# EAGLE design led_cube (EAGLE 6.4)
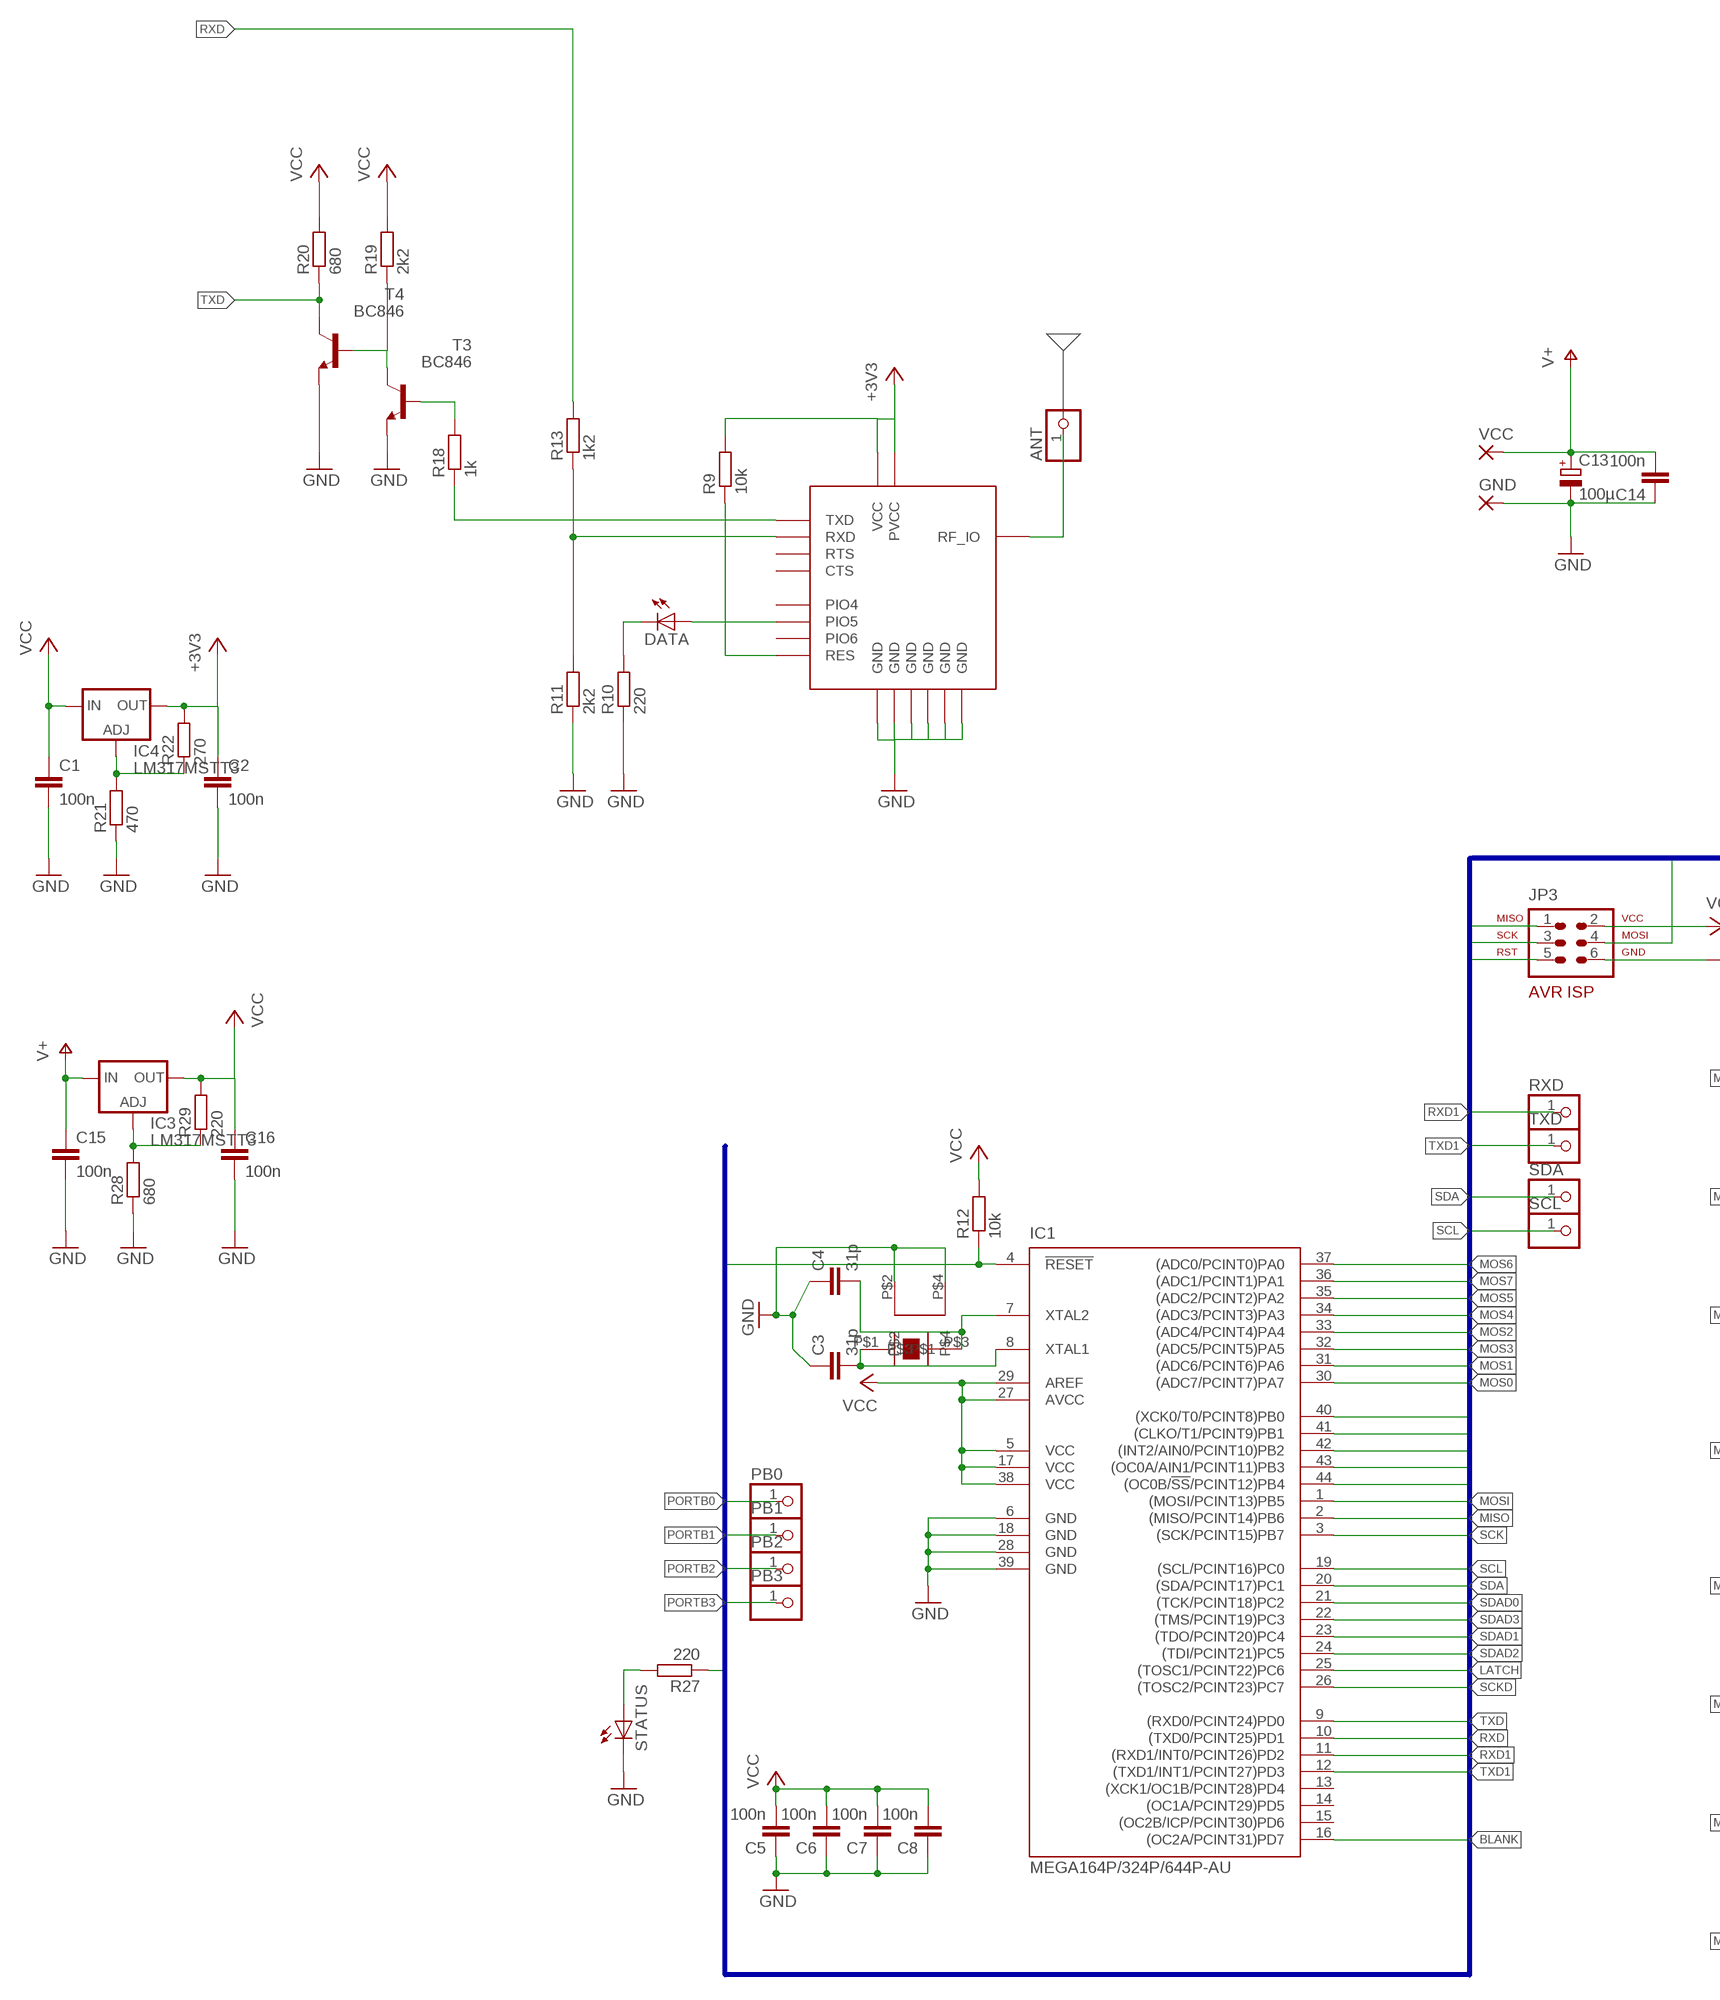
[diagram p0: schematic, sheet 1, part 1 of 2]
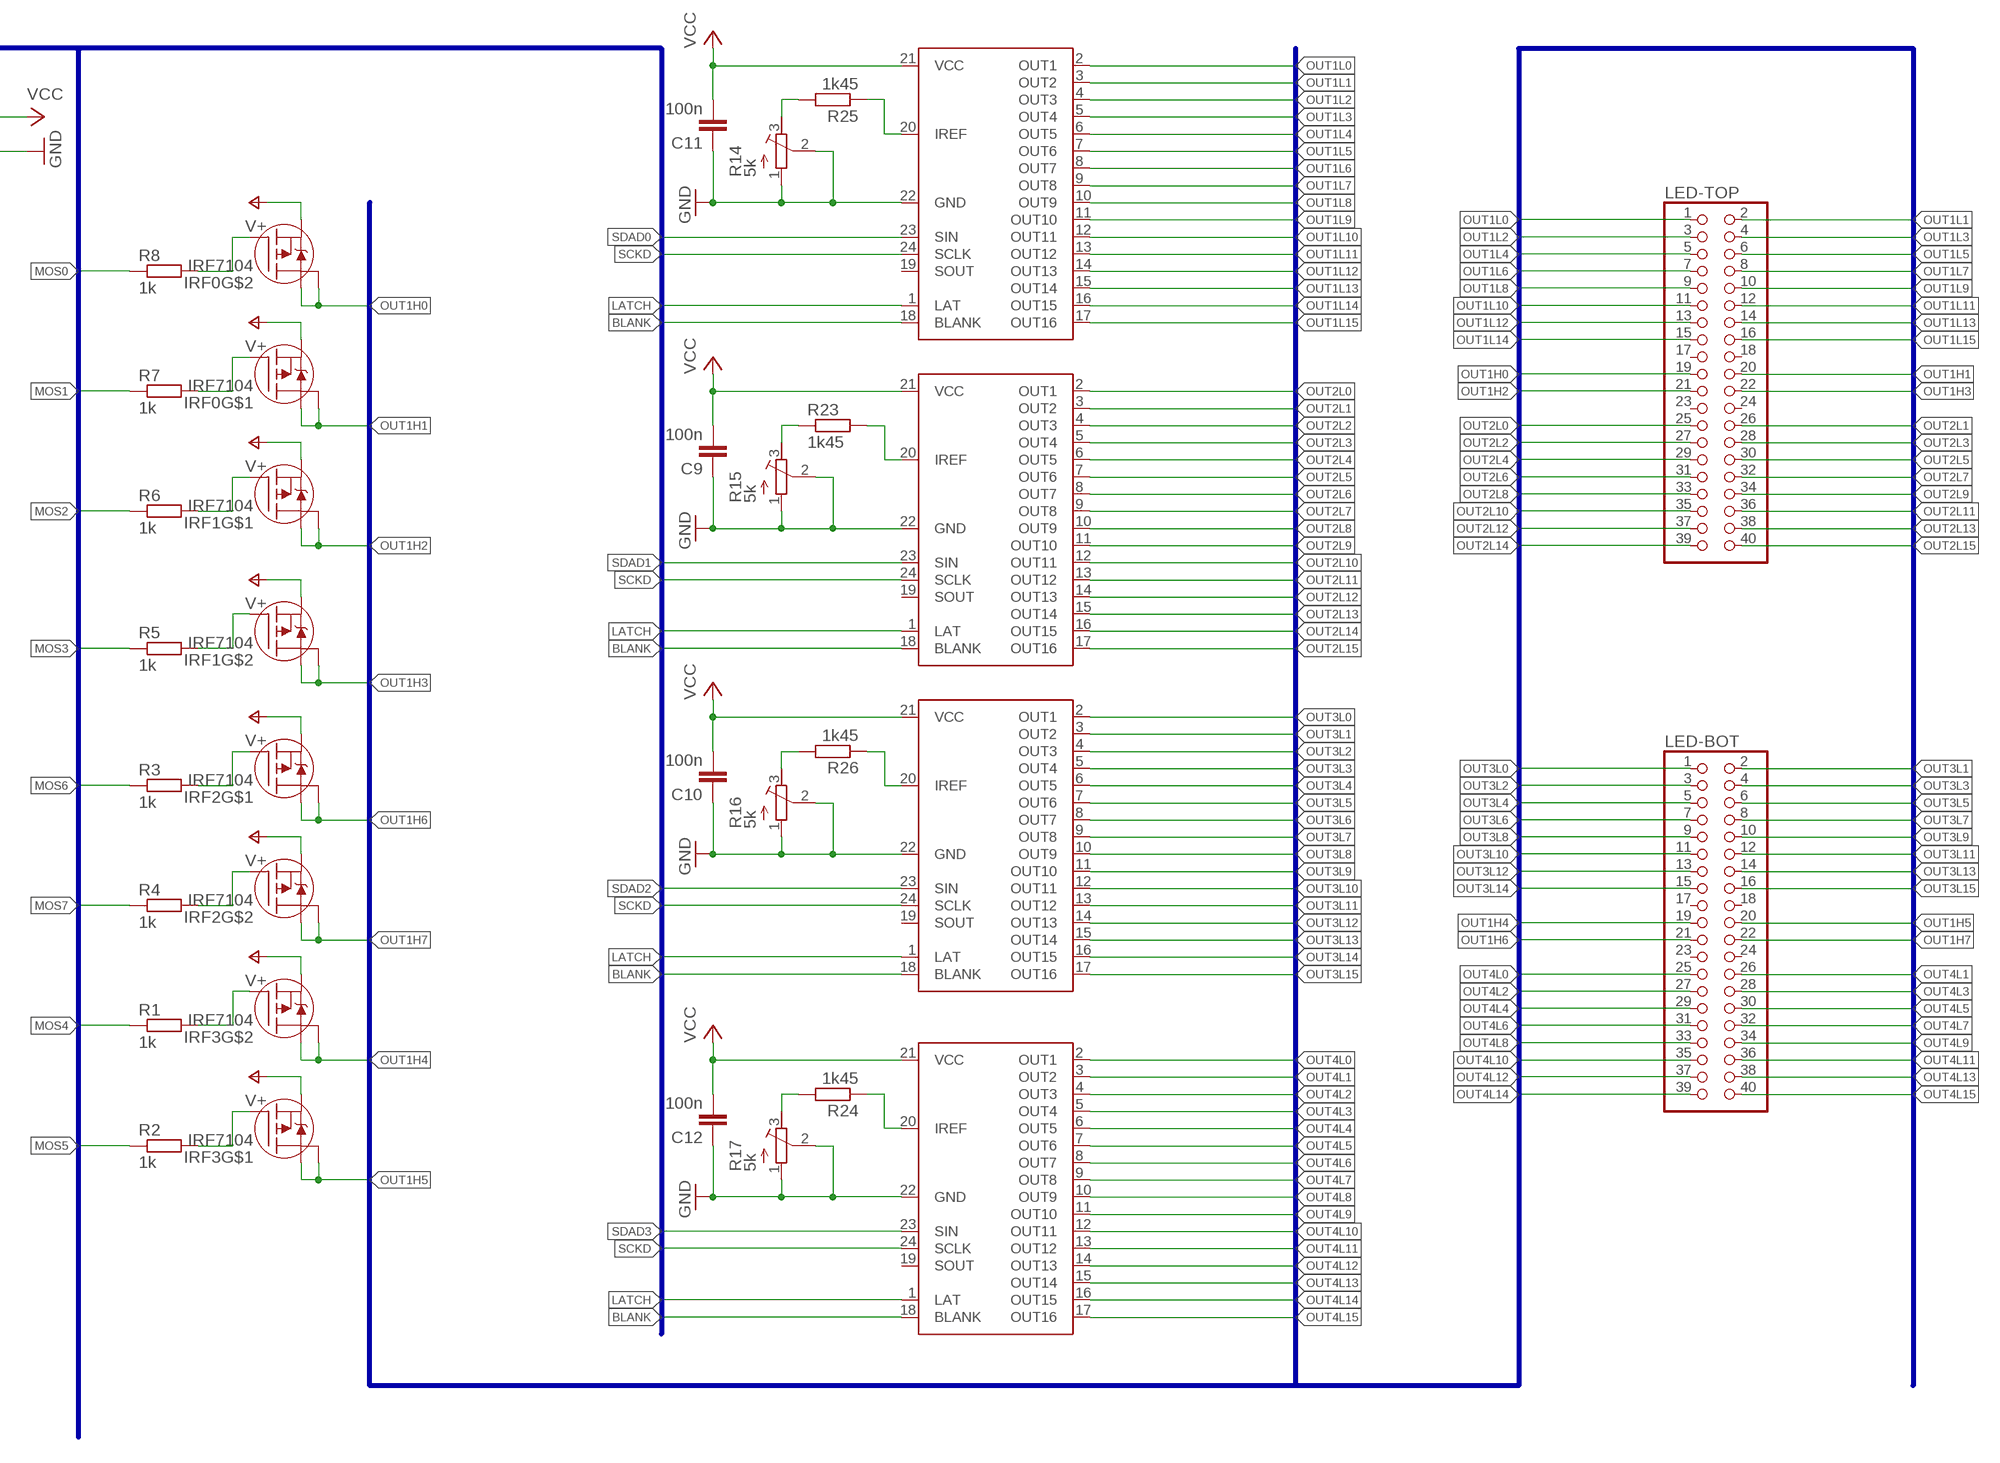
[diagram p1: schematic, sheet 1, part 2 of 2]

## Parts
ANT  PINHD-1X1  [1X01]
C1  100n  C-EUC0805  [C0805]
C2  100n  C-EUC0805  [C0805]
C3  31p  C-EUC0805  [C0805]
C4  31p  C-EUC0805  [C0805]
C5  100n  C-EUC0805  [C0805]
C6  100n  C-EUC0805  [C0805]
C7  100n  C-EUC0805  [C0805]
C8  100n  C-EUC0805  [C0805]
C9  100n  C-EUC0805  [C0805]
C10  100n  C-EUC0805  [C0805]
C11  100n  C-EUC0805  [C0805]
C12  100n  C-EUC0805  [C0805]
C13  100µ  CPOL-EUD  [PANASONIC_D]
C14  100n  C-EUC0805  [C0805]
C15  100n  C-EUC0805  [C0805]
C16  100n  C-EUC0805  [C0805]
DATA  LEDCHIPLED_1206  [CHIPLED_1206]
GND  2,54/1,0  [2,54/1,0]
IC1  MEGA164P/324P/644P-AU  [TQFP44]
IC2  BTM_SER  [BTM_222]
IC3  LM317MSTT3  [SOT223]
IC4  LM317MSTT3  [SOT223]
IRF0  IRF7104  [SO8-2]
IRF1  IRF7104  [SO8-2]
IRF2  IRF7104  [SO8-2]
IRF3  IRF7104  [SO8-2]
JP3  AVR-ISP-6VERT  [AVR-ISP-6]
LED-BOT  PINHD-2X20  [2X20]
LED-TOP  PINHD-2X20  [2X20]
PB0  PINHD-1X1  [1X01]
PB1  PINHD-1X1  [1X01]
PB2  PINHD-1X1  [1X01]
PB3  PINHD-1X1  [1X01]
R1  1k  R-EU_R0805  [R0805]
R2  1k  R-EU_R0805  [R0805]
R3  1k  R-EU_R0805  [R0805]
R4  1k  R-EU_R0805  [R0805]
R5  1k  R-EU_R0805  [R0805]
R6  1k  R-EU_R0805  [R0805]
R7  1k  R-EU_R0805  [R0805]
R8  1k  R-EU_R0805  [R0805]
R9  10k  R-EU_R0805  [R0805]
R10  220  R-EU_R0805  [R0805]
R11  2k2  R-EU_R0805  [R0805]
R12  10k  R-EU_R0805  [R0805]
R13  1k2  R-EU_R0805  [R0805]
R14  5k  R-TRIMM3202  [RTRIM3202]
R15  5k  R-TRIMM3202  [RTRIM3202]
R16  5k  R-TRIMM3202  [RTRIM3202]
R17  5k  R-TRIMM3202  [RTRIM3202]
R18  1k  R-EU_R0805  [R0805]
R19  2k2  R-EU_R0805  [R0805]
R20  680  R-EU_R0805  [R0805]
R21  470  R-EU_R0805  [R0805]
R22  270  R-EU_R0805  [R0805]
R23  1k45  R-EU_R0805  [R0805]
R24  1k45  R-EU_R0805  [R0805]
R25  1k45  R-EU_R0805  [R0805]
R26  1k45  R-EU_R0805  [R0805]
R27  220  R-EU_R0805  [R0805]
R28  680  R-EU_R0805  [R0805]
R29  220  R-EU_R0805  [R0805]
RXD  PINHD-1X1  [1X01]
SCL  PINHD-1X1  [1X01]
SDA  PINHD-1X1  [1X01]
STATUS  LEDCHIPLED_1206  [CHIPLED_1206]
T3  BC846  [SOT23]
T4  BC846  [SOT23]
TLC0  TLC5929RGE  [HVQFN24]
TLC1  TLC5929RGE  [HVQFN24]
TLC2  TLC5929RGE  [HVQFN24]
TLC3  TLC5929RGE  [HVQFN24]
TXD  PINHD-1X1  [1X01]
U$9  ABMM2  [ABMM2]
VCC  2,54/1,0  [2,54/1,0]

## Nets
+3V3: C2.1 IC2.P$2(PVCC) IC2.P$17(VCC) IC4.4(OUT) R9.2 R22.2
BLANK: IC1.16((OC2A/PCINT31)PD7) TLC0.18(BLANK) TLC1.18(BLANK) TLC2.18(BLANK) TLC3.18(BLANK)
GND: C1.2 C2.2 C3.1 C4.1 C5.1 C6.1 C7.1 C8.1 C9.1 C10.1 C11.1 C12.1 C13.- C14.1 C15.2 C16.2 GND.1(P) IC1.6(GND) IC1.18(GND) IC1.28(GND) IC1.39(GND) IC2.P$1(GND) IC2.P$10(GND) IC2.P$18(GND) IC2.P$19(GND) IC2.P$29(GND) IC2.P$38(GND) JP3.6 R10.1 R11.1 R14.1(A) R14.2(S) R15.1(A) R15.2(S) R16.1(A) R16.2(S) R17.1(A) R17.2(S) R21.1 R28.1 STATUS.C T3.2(E) T4.2(E) TLC0.22(GND) TLC1.22(GND) TLC2.22(GND) TLC3.22(GND) U$9.P$2 U$9.P$4
LATCH: IC1.25((TOSC1/PCINT22)PC6) TLC0.1(LAT) TLC1.1(LAT) TLC2.1(LAT) TLC3.1(LAT)
MISO: IC1.2((MISO/PCINT14)PB6) JP3.1
MOS0: IC1.30((ADC7/PCINT7)PA7) R8.1
MOS1: IC1.31((ADC6/PCINT6)PA6) R7.1
MOS2: IC1.33((ADC4/PCINT4)PA4) R6.1
MOS3: IC1.32((ADC5/PCINT5)PA5) R5.1
MOS4: IC1.34((ADC3/PCINT3)PA3) R1.1
MOS5: IC1.35((ADC2/PCINT2)PA2) R2.1
MOS6: IC1.37((ADC0/PCINT0)PA0) R3.1
MOS7: IC1.36((ADC1/PCINT1)PA1) R4.1
MOSI: IC1.1((MOSI/PCINT13)PB5) JP3.4
N$1: C3.2 IC1.8(XTAL1) U$9.P$1
N$2: IC2.P$26(RXD) R11.2 R13.1
N$3: C4.2 IC1.7(XTAL2) U$9.P$3
N$4: IRF3.2(G) R2.2
N$5: IC2.P$16(RES) R9.1
N$6: DATA.A IC2.P$11(PIO5)
N$7: DATA.C R10.2
N$8: IRF3.4(G) R1.2
N$9: IRF2.4(G) R4.2
N$10: IC2.P$27(TXD) R18.1
N$11: R18.2 T3.1(B)
N$12: R19.1 T3.3(C) T4.1(B)
N$13: IRF2.2(G) R3.2
N$14: IC4.1(ADJ) R21.2 R22.1
N$15: IRF1.4(G) R5.2
N$16: IRF1.2(G) R6.2
N$17: IRF0.2(G) R7.2
N$18: IRF0.4(G) R8.2
N$19: R24.1 TLC3.20(IREF)
N$20: R17.3(E) R24.2
N$21: R16.3(E) R26.2
N$22: R26.1 TLC2.20(IREF)
N$23: R23.2 TLC1.20(IREF)
N$24: R15.3(E) R23.1
N$25: R14.3(E) R25.2
N$26: R25.1 TLC0.20(IREF)
N$27: ANT.1 IC2.P$37(RF_IO)
N$28: R27.2 STATUS.A
N$29: IC3.1(ADJ) R28.2 R29.1
OUT1H0: IRF0.5(D) IRF0.6(D) LED-TOP.19
OUT1H1: IRF0.7(D) IRF0.8(D) LED-TOP.20
OUT1H2: IRF1.7(D) IRF1.8(D) LED-TOP.21
OUT1H3: IRF1.5(D) IRF1.6(D) LED-TOP.22
OUT1H4: IRF3.5(D) IRF3.6(D) LED-BOT.19
OUT1H5: IRF3.7(D) IRF3.8(D) LED-BOT.20
OUT1H6: IRF2.7(D) IRF2.8(D) LED-BOT.21
OUT1H7: IRF2.5(D) IRF2.6(D) LED-BOT.22
OUT1L0: LED-TOP.1 TLC0.2(OUT1)
OUT1L1: LED-TOP.2 TLC0.3(OUT2)
OUT1L2: LED-TOP.3 TLC0.4(OUT3)
OUT1L3: LED-TOP.4 TLC0.5(OUT4)
OUT1L4: LED-TOP.5 TLC0.6(OUT5)
OUT1L5: LED-TOP.6 TLC0.7(OUT6)
OUT1L6: LED-TOP.7 TLC0.8(OUT7)
OUT1L7: LED-TOP.8 TLC0.9(OUT8)
OUT1L8: LED-TOP.9 TLC0.10(OUT9)
OUT1L9: LED-TOP.10 TLC0.11(OUT10)
OUT1L10: LED-TOP.11 TLC0.12(OUT11)
OUT1L11: LED-TOP.12 TLC0.13(OUT12)
OUT1L12: LED-TOP.13 TLC0.14(OUT13)
OUT1L13: LED-TOP.14 TLC0.15(OUT14)
OUT1L14: LED-TOP.15 TLC0.16(OUT15)
OUT1L15: LED-TOP.16 TLC0.17(OUT16)
OUT2L0: LED-TOP.25 TLC1.2(OUT1)
OUT2L1: LED-TOP.26 TLC1.3(OUT2)
OUT2L2: LED-TOP.27 TLC1.4(OUT3)
OUT2L3: LED-TOP.28 TLC1.5(OUT4)
OUT2L4: LED-TOP.29 TLC1.6(OUT5)
OUT2L5: LED-TOP.30 TLC1.7(OUT6)
OUT2L6: LED-TOP.31 TLC1.8(OUT7)
OUT2L7: LED-TOP.32 TLC1.9(OUT8)
OUT2L8: LED-TOP.33 TLC1.10(OUT9)
OUT2L9: LED-TOP.34 TLC1.11(OUT10)
OUT2L10: LED-TOP.35 TLC1.12(OUT11)
OUT2L11: LED-TOP.36 TLC1.13(OUT12)
OUT2L12: LED-TOP.37 TLC1.14(OUT13)
OUT2L13: LED-TOP.38 TLC1.15(OUT14)
OUT2L14: LED-TOP.39 TLC1.16(OUT15)
OUT2L15: LED-TOP.40 TLC1.17(OUT16)
OUT3L0: LED-BOT.1 TLC2.2(OUT1)
OUT3L1: LED-BOT.2 TLC2.3(OUT2)
OUT3L2: LED-BOT.3 TLC2.4(OUT3)
OUT3L3: LED-BOT.4 TLC2.5(OUT4)
OUT3L4: LED-BOT.5 TLC2.6(OUT5)
OUT3L5: LED-BOT.6 TLC2.7(OUT6)
OUT3L6: LED-BOT.7 TLC2.8(OUT7)
OUT3L7: LED-BOT.8 TLC2.9(OUT8)
OUT3L8: LED-BOT.9 TLC2.10(OUT9)
OUT3L9: LED-BOT.10 TLC2.11(OUT10)
OUT3L10: LED-BOT.11 TLC2.12(OUT11)
OUT3L11: LED-BOT.12 TLC2.13(OUT12)
OUT3L12: LED-BOT.13 TLC2.14(OUT13)
OUT3L13: LED-BOT.14 TLC2.15(OUT14)
OUT3L14: LED-BOT.15 TLC2.16(OUT15)
OUT3L15: LED-BOT.16 TLC2.17(OUT16)
OUT4L0: LED-BOT.25 TLC3.2(OUT1)
OUT4L1: LED-BOT.26 TLC3.3(OUT2)
OUT4L2: LED-BOT.27 TLC3.4(OUT3)
OUT4L3: LED-BOT.28 TLC3.5(OUT4)
OUT4L4: LED-BOT.29 TLC3.6(OUT5)
OUT4L5: LED-BOT.30 TLC3.7(OUT6)
OUT4L6: LED-BOT.31 TLC3.8(OUT7)
OUT4L7: LED-BOT.32 TLC3.9(OUT8)
OUT4L8: LED-BOT.33 TLC3.10(OUT9)
OUT4L9: LED-BOT.34 TLC3.11(OUT10)
OUT4L10: LED-BOT.35 TLC3.12(OUT11)
OUT4L11: LED-BOT.36 TLC3.13(OUT12)
OUT4L12: LED-BOT.37 TLC3.14(OUT13)
OUT4L13: LED-BOT.38 TLC3.15(OUT14)
OUT4L14: LED-BOT.39 TLC3.16(OUT15)
OUT4L15: LED-BOT.40 TLC3.17(OUT16)
PORTB0: IC1.40((XCK0/T0/PCINT8)PB0) PB0.1
PORTB1: IC1.41((CLKO/T1/PCINT9)PB1) PB1.1
PORTB2: IC1.42((INT2/AIN0/PCINT10)PB2) PB2.1
PORTB3: IC1.43((OC0A/AIN1/PCINT11)PB3) PB3.1
PORTB4: IC1.44((OC0B/!SS!/PCINT12)PB4) R27.1
RST: IC1.4(!RESET) JP3.5 R12.1
RXD: IC1.10((TXD0/PCINT25)PD1) R13.2
RXD1: IC1.11((RXD1/INT0/PCINT26)PD2) RXD.1
SCK: IC1.3((SCK/PCINT15)PB7) JP3.3
SCKD: IC1.26((TOSC2/PCINT23)PC7) TLC0.24(SCLK) TLC1.24(SCLK) TLC2.24(SCLK) TLC3.24(SCLK)
SCL: IC1.19((SCL/PCINT16)PC0) SCL.1
SDA: IC1.20((SDA/PCINT17)PC1) SDA.1
SDAD0: IC1.21((TCK/PCINT18)PC2) TLC0.23(SIN)
SDAD1: IC1.23((TDO/PCINT20)PC4) TLC1.23(SIN)
SDAD2: IC1.24((TDI/PCINT21)PC5) TLC2.23(SIN)
SDAD3: IC1.22((TMS/PCINT19)PC3) TLC3.23(SIN)
TXD: IC1.9((RXD0/PCINT24)PD0) R20.1 T4.3(C)
TXD1: IC1.12((TXD1/INT1/PCINT27)PD3) TXD.1
V+: C13.+ C14.2 C15.1 IC3.3(IN) IRF0.1(S) IRF0.3(S) IRF1.1(S) IRF1.3(S) IRF2.1(S) IRF2.3(S) IRF3.1(S) IRF3.3(S) VCC.1(P)
VCC: C1.1 C5.2 C6.2 C7.2 C8.2 C9.2 C10.2 C11.2 C12.2 C16.1 IC1.5(VCC) IC1.17(VCC) IC1.27(AVCC) IC1.29(AREF) IC1.38(VCC) IC3.4(OUT) IC4.3(IN) JP3.2 R12.2 R19.2 R20.2 R29.2 TLC0.21(VCC) TLC1.21(VCC) TLC2.21(VCC) TLC3.21(VCC)
Unconnected: IC1.13((XCK1/OC1B/PCINT28)PD4) IC1.14((OC1A/PCINT29)PD5) IC1.15((OC2B/ICP/PCINT30)PD6) IC2.P$9(PIO4) IC2.P$12(PIO6) IC2.P$28(RTS) IC2.P$30(CTS) LED-BOT.17 LED-BOT.18 LED-BOT.23 LED-BOT.24 LED-TOP.17 LED-TOP.18 LED-TOP.23 LED-TOP.24 TLC0.19(SOUT) TLC1.19(SOUT) TLC2.19(SOUT) TLC3.19(SOUT)

## Buses
MISO,MOSI,SCK,RST,SCKD,SDAD[0..3],MOS[0..7],BLANK,LATCH,RXD,TXD,RXD1,TXD1,SDA,SCL,PORTB[0..4]
OUT1L[0..15],OUT2L[0..15],OUT3L[0..15],OUT4L[0..15],OUT1H[0..7]

## Library data of the parts
ANT PB0 PB1-PB3 RXD SCL SDA TXD = pinhead:PINHD-1X1: PIN HEADER
C1-C12 C14-C16 = resistor:C-EU: CAPACITOR, European symbol
C13 = rcl:CPOL-EU: POLARIZED CAPACITOR, European symbol
DATA STATUS = led:LED: LED OSRAM: - CHIPLED LG R971, LG N971, LY N971, LG Q971, LY Q971, LO R971, LY R971 LH N974, LH R974 LS Q976, LO Q976, LY Q976 LO Q996 - Hyper CHIPLED LW Q18S LB Q993, LB Q99A, LB R99A - SideLED LS A670, LO A670, LY A670, LG A670, LP A670 LB A673, LV A673, LT A673, LW A673 LH A674 LY A675 LS A676, LA A676, LO A676, LY A676, LW A676 LS A679, LY A679, LG A679 - Hyper Micro SIDELED® LS Y876, LA Y876, LO Y876, LY Y876 LT Y87S - SmartLED LW L88C, LW L88S LB L89C, LB L89S, LG L890 LS L89K, LO L89K, LY L89K LS L896, LA L896, LO L896, LY L896 - TOPLED LS T670, LO T670, LY T670, LG T670, LP T670 LSG T670, LSP T670, LSY T670, LOP T670, LYG T670 LG T671, LOG T671, LSG T671 LB T673, LV T673, LT T673, LW T673 LH T674 LS T676, LA T676, LO T676, LY T676, LB T676, LH T676, LSB T676, LW T676 LB T67C, LV T67C, LT T67C, LS T67K, LO T67K, LY T67K, LW E67C LS E67B, LA E67B, LO E67B, LY E67B, LB E67C, LV E67C, LT E67C LW T67C LS T679, LY T679, LG T679 LS T770, LO T770, LY T770, LG T770, LP T770 LB T773, LV T773, LT T773, LW T773 LH T774 LS E675, LA E675, LY E675, LS T675 LS T776, LA T776, LO T776, LY T776, LB T776 LHGB T686 LT T68C, LB T68C - Hyper Mini TOPLED® LB M676 - Mini TOPLED Santana® LG M470 LS M47K, LO M47K, LY M47K Source: http://www.osram.convergy.de LUXEON: - LUMILED® LXK2-PW12-R00, LXK2-PW12-S00, LXK2-PW14-U00, LXK2-PW14-V00 LXK2-PM12-R00, LXK2-PM12-S00, LXK2-PM14-U00 LXK2-PE12-Q00, LXK2-PE12-R00, LXK2-PE12-S00, LXK2-PE14-T00, LXK2-PE14-U00 LXK2-PB12-K00, LXK2-PB12-L00, LXK2-PB12-M00, LXK2-PB14-N00, LXK2-PB14-P00, LXK2-PB14-Q00 LXK2-PR12-L00, LXK2-PR12-M00, LXK2-PR14-Q00, LXK2-PR14-R00 LXK2-PD12-Q00, LXK2-PD12-R00, LXK2-PD12-S00 LXK2-PH12-R00, LXK2-PH12-S00 LXK2-PL12-P00, LXK2-PL12-Q00, LXK2-PL12-R00 Source: www.luxeon.com KINGBRIGHT: KA-3528ASYC Source: www.kingbright.com
GND VCC = wirepad:2,54/1,0: THROUGH-HOLE PAD
IC1 = avr-7:MEGA164P/324P/644P-AU
IC2 = BTM222:BTM_SER
IC3 IC4 = v-reg:LM317?*: 500 mA Adjustable Output Positive Voltage Regulator Source: http://www.onsemi.co.jp .. LM317M-D.PDF
IRF0 IRF1-IRF3 = irf-2:IRF7104: HEXFET® Power MOSFET Adavanced Process Technology Ultra Low On-Resistance Dual P-Channel MOSFET Surface Mount Available in Tape & Reel Dynamic dv/dt Rating Fast Switching Please connect both Drain-Pins of each FET for thermal Reasons! (Pin 5 with Pin 6, 7 with 8)
JP3 = avr-7:AVR-ISP-6: AVR ISP-6 Serial Programming Header
LED-BOT LED-TOP = pinhead:PINHD-2X20: PIN HEADER
R1-R13 R18-R29 = resistor:R-EU_: RESISTOR, European symbol
R14-R17 = rcl:R-TRIMM: Trimm resistor
T3 T4 = transistor:BC846: NPN TRANSISTOR
TLC0 TLC1-TLC3 = texas:TLC5929
U$9 = crystal:ABMM2

## Board
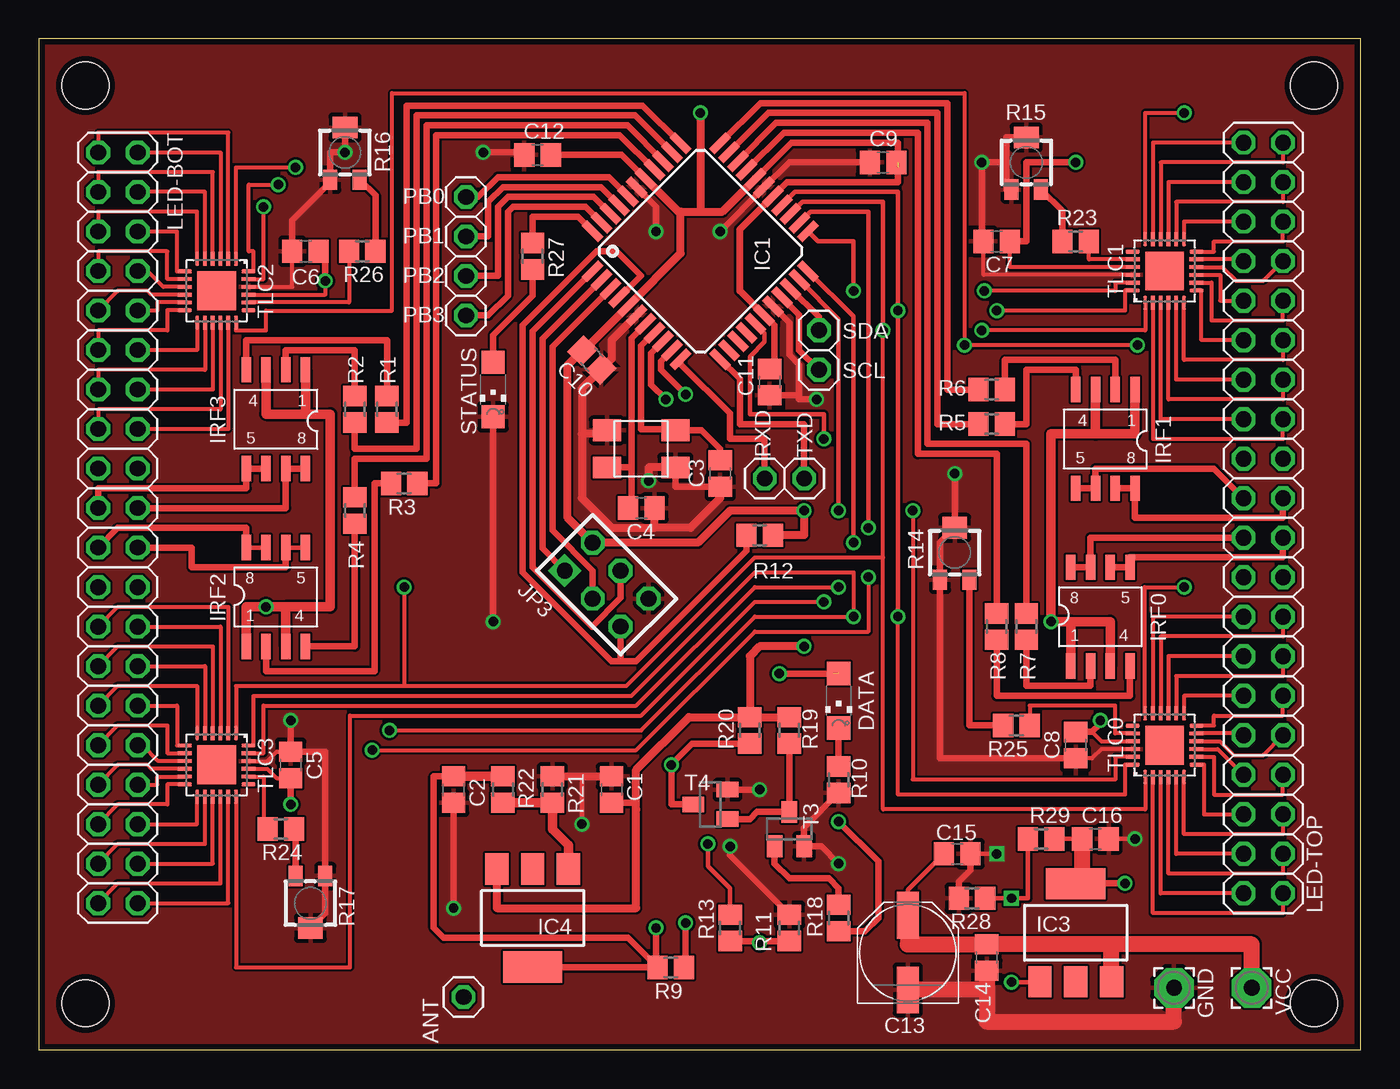
[diagram p2: board, top side]
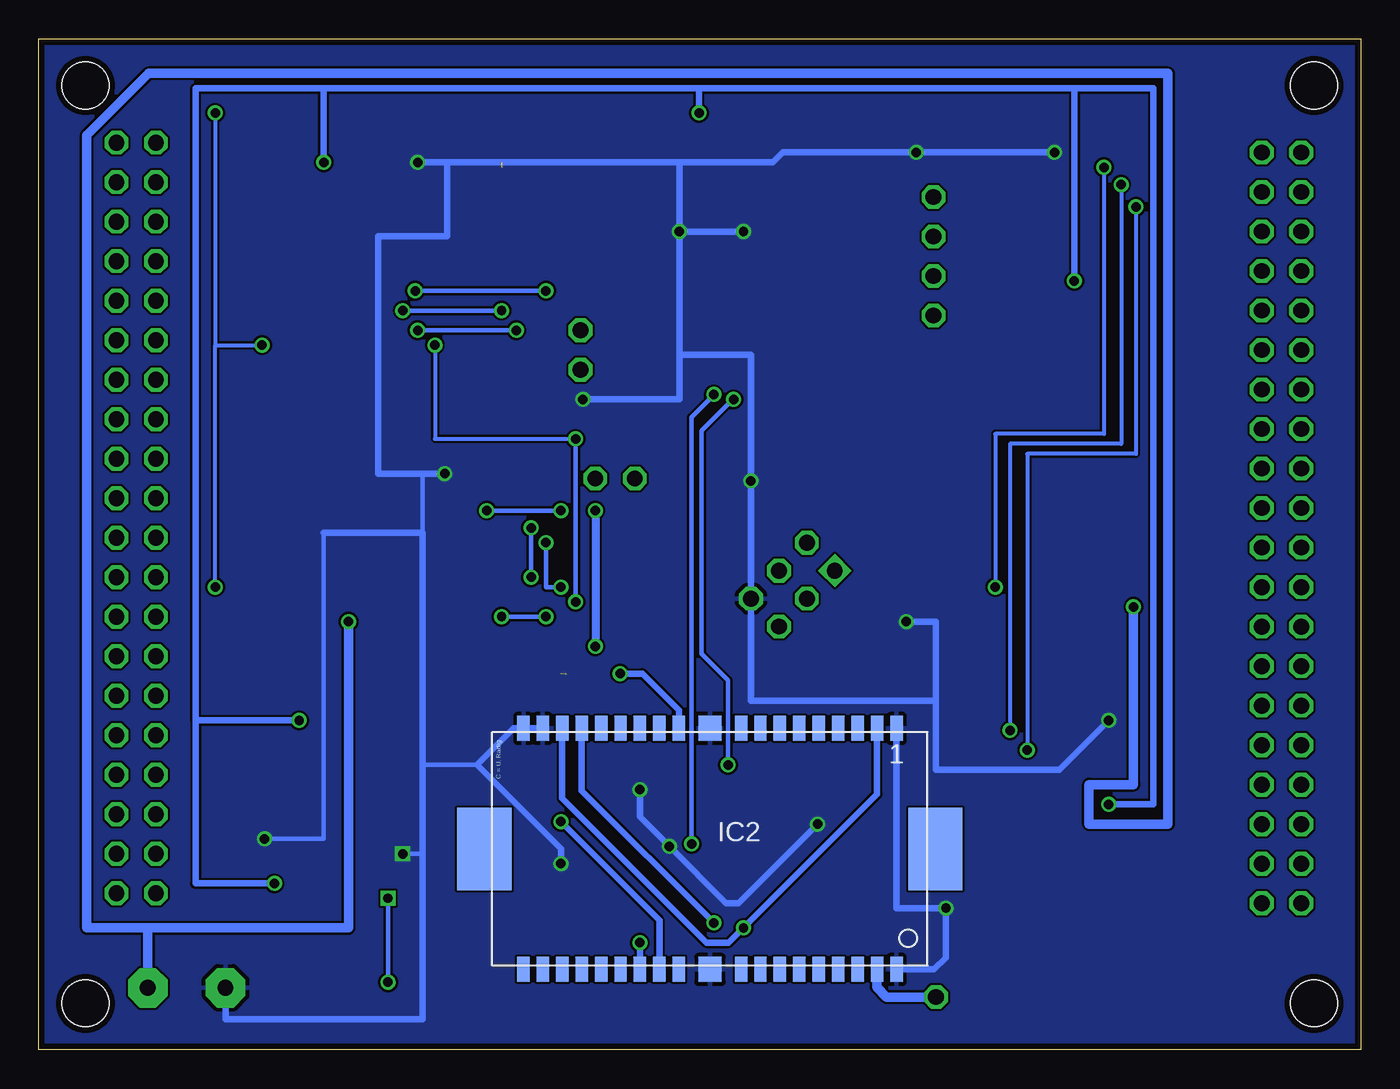
[diagram p3: board, bottom side, seen from below]

Size 85 x 65 mm. Coordinates in mm from the lower left corner, seen from the top.
Outline: 0,65 0,0 85,0 85,65 0,65
Copper layers (1*16): Top 0.0356mm / dielectric 1.5011mm / Bottom 0.0356mm
Design rules "LaenPCBOrder *": minimum track width 6mil, minimum drill 13mil, track to track 6mil, track to pad 6mil, pad to pad 6mil, via to via 6mil, smd to smd 6mil, copper to edge 15mil, drill to drill 6mil, minimum pad ring 7mil, minimum via ring 7mil, stop-mask expansion 3mil, vias tented up to drill 0mil, thermal gap 10mil
Holes 3 mm at 3,62 3,3 82,62 82,3

### Footprints (pad centres in the part's own frame; a part is rotated, then mirrored left to right if it is on the bottom)
1X01 = drill 1.016 octagon: 1 0,0
C0805 = smd 1.3 x 1.5: 1 -0.85,0; 2 0.85,0
PANASONIC_D = smd 3 x 1.4: + 2.4,0; - -2.4,0
CHIPLED_1206 = smd 1.5 x 1.5: A 0,-1.75; C 0,1.75
2,54/1,0 = drill 1.016 pad 2.54 octagon: 1 0,0
TQFP44 = smd 1.5 x 0.5: 1 -5.8,4; 2 -5.8,3.2; 3 -5.8,2.4; 4 -5.8,1.6; 5 -5.8,0.8; 6 -5.8,0; 7 -5.8,-0.8; 8 -5.8,-1.6; 9 -5.8,-2.4; 10 -5.8,-3.2; 11 -5.8,-4; 23 5.8,-4; 24 5.8,-3.2; 25 5.8,-2.4; 26 5.8,-1.6; 27 5.8,-0.8; 28 5.8,0; 29 5.8,0.8; 30 5.8,1.6; 31 5.8,2.4; 32 5.8,3.2; 33 5.8,4 | smd 0.5 x 1.5: 12 -4,-5.8; 13 -3.2,-5.8; 14 -2.4,-5.8; 15 -1.6,-5.8; 16 -0.8,-5.8; 17 0,-5.8; 18 0.8,-5.8; 19 1.6,-5.8; 20 2.4,-5.8; 21 3.2,-5.8; 22 4,-5.8; 34 4,5.8; 35 3.2,5.8; 36 2.4,5.8; 37 1.6,5.8; 38 0.8,5.8; 39 0,5.8; 40 -0.8,5.8; 41 -1.6,5.8; 42 -2.4,5.8; 43 -3.2,5.8; 44 -4,5.8
BTM_222 = smd 0.8 x 1.6: P$1 -11.43,-7.75; P$2 -10.18,-7.75; P$3 -8.93,-7.75; P$4 -7.68,-7.75; P$5 -6.43,-7.75; P$6 -5.18,-7.75; P$7 -3.93,-7.75; P$8 -2.68,-7.75; P$9 -1.43,-7.75; P$11 2.57,-7.75; P$12 3.82,-7.75; P$13 5.07,-7.75; P$14 6.32,-7.75; P$15 7.57,-7.75; P$16 8.82,-7.75; P$17 10.07,-7.75; P$18 11.32,-7.75; P$19 12.57,-7.75; P$20 12.57,7.75; P$21 11.32,7.75; P$22 10.07,7.75; P$23 8.82,7.75; P$24 7.57,7.75; P$25 6.32,7.75; P$26 5.07,7.75; P$27 3.82,7.75; P$28 2.57,7.75; P$30 -1.43,7.75; P$31 -2.68,7.75; P$32 -3.93,7.75; P$33 -5.18,7.75; P$34 -6.43,7.75; P$35 -7.68,7.75; P$36 -8.93,7.75; P$37 -10.18,7.75; P$38 -11.43,7.75 | smd 1.5 x 1.6: P$10 0.57,-7.75; P$29 0.57,7.75 | smd 3.5 x 5.3: P$39 -13.93,0; P$40 15.07,0
SOT223 = smd 1.5 x 2: 1 -2.3,-3.15; 2 0,-3.15; 3 2.3,-3.15 | smd 3.8 x 2: 4 0,3.15
SO8-2 = smd 0.61 x 1.626: 1 -2.54,-2.54; 2 -1.27,-2.54; 3 0,-2.54; 4 1.27,-2.54; 5 1.27,3.81; 6 0,3.81; 7 -1.27,3.81; 8 -2.54,3.81
AVR-ISP-6 = drill 1.016 square: 1 -2.54,-1.27 | drill 1.016 octagon: 2 -2.54,1.27; 3 0,-1.27; 4 0,1.27; 5 2.54,-1.27; 6 2.54,1.27
2X20 = drill 1.016 octagon: 1 -24.13,-1.27; 2 -24.13,1.27; 3 -21.59,-1.27; 4 -21.59,1.27; 5 -19.05,-1.27; 6 -19.05,1.27; 7 -16.51,-1.27; 8 -16.51,1.27; 9 -13.97,-1.27; 10 -13.97,1.27; 11 -11.43,-1.27; 12 -11.43,1.27; 13 -8.89,-1.27; 14 -8.89,1.27; 15 -6.35,-1.27; 16 -6.35,1.27; 17 -3.81,-1.27; 18 -3.81,1.27; 19 -1.27,-1.27; 20 -1.27,1.27; 21 1.27,-1.27; 22 1.27,1.27; 23 3.81,-1.27; 24 3.81,1.27; 25 6.35,-1.27; 26 6.35,1.27; 27 8.89,-1.27; 28 8.89,1.27; 29 11.43,-1.27; 30 11.43,1.27; 31 13.97,-1.27; 32 13.97,1.27; 33 16.51,-1.27; 34 16.51,1.27; 35 19.05,-1.27; 36 19.05,1.27; 37 21.59,-1.27; 38 21.59,1.27; 39 24.13,-1.27; 40 24.13,1.27
R0805 = smd 1.3 x 1.5: 1 -0.85,0; 2 0.85,0
RTRIM3202 = smd 0.9 x 1.3: 1 -0.95,-1.75; 3 0.95,-1.75 | smd 1.6 x 1.4: 2 0,1.6
SOT23 = smd 1 x 1.4: 1 -0.95,-1.1; 2 0.95,-1.1; 3 0,1.1
HVQFN24 = smd 0.9 x 0.24: 1 -2.05,1.25; 2 -2.05,0.75; 3 -2.05,0.25; 4 -2.05,-0.25; 5 -2.05,-0.75; 6 -2.05,-1.25; 13 2.05,-1.25; 14 2.05,-0.75; 15 2.05,-0.25; 16 2.05,0.25; 17 2.05,0.75; 18 2.05,1.25 | smd 0.24 x 0.9: 7 -1.25,-2.05; 8 -0.75,-2.05; 9 -0.25,-2.05; 10 0.25,-2.05; 11 0.75,-2.05; 12 1.25,-2.05; 19 1.25,2.05; 20 0.75,2.05; 21 0.25,2.05; 22 -0.25,2.05; 23 -0.75,2.05; 24 -1.25,2.05 | smd 2.5 x 2.5: 25 0,0 | smd 0.25 x 0.25: M1 -1.87,1.87
ABMM2 = smd 1.8 x 1.4: P$1 -2.2,-1.2; P$2 2.2,-1.2; P$3 2.2,1.2; P$4 -2.2,1.2

### Placement (x,y rotation side)
ANT  27.3,3.41 270 top
C1  36.83,16.74 90 top
C2  26.67,16.74 270 top
C3  43.82,37.06 90 top
C4  38.73,34.84 180 top
C5  16.19,18.33 270 top
C6  17.14,51.35 0 top
C7  61.6,51.98 0 top
C8  66.67,19.6 90 top
C9  54.29,57.06 0 top
C10  35.56,44.36 135 top
C11  46.99,42.93 90 top
C12  32.07,57.54 0 top
C13  55.88,6.26 90 top
C14  60.96,5.95 90 top
C15  59.05,12.61 0 top
C16  67.95,13.56 0 top
DATA  51.44,22.45 180 top
GND  73,4 270 top
IC1  42.55,51.35 45 top
IC2  41.27,12.93 180 bottom
IC3  66.67,7.53 0 top
IC4  31.75,8.48 180 top
IRF0  68.9,27.22 0 top
IRF1  67.95,39.92 180 top
IRF2  15.88,28.49 0 top
IRF3  14.61,41.19 180 top
JP3  36.51,29.92 315 top
LED-BOT  5.08,33.57 270 top
LED-TOP  78.74,34.2 90 top
PB0  27.46,54.84 270 top
PB1  27.46,52.3 270 top
PB2  27.46,49.76 270 top
PB3  27.46,47.22 270 top
R1  22.38,41.19 90 top
R2  20.32,41.19 90 top
R3  23.5,36.43 180 top
R4  20.32,34.68 270 top
R5  61.28,40.23 0 top
R6  61.28,42.46 0 top
R7  63.5,27.22 270 top
R8  61.6,27.22 270 top
R9  40.64,5.31 180 top
R10  51.44,17.38 90 top
R11  48.26,7.85 270 top
R12  46.36,33.09 0 top
R13  44.45,7.85 90 top
R14  58.9,31.98 0 top
R15  63.5,57.06 0 top
R16  19.69,57.7 0 top
R17  17.46,9.44 180 top
R18  51.44,8.48 90 top
R19  48.26,20.55 90 top
R20  45.72,20.55 90 top
R21  33.02,16.74 270 top
R22  29.85,16.74 90 top
R23  66.67,51.98 0 top
R24  15.56,14.2 0 top
R25  62.86,20.87 180 top
R26  20.8,51.35 0 top
R27  31.75,51.03 270 top
R28  60.01,9.75 0 top
R29  64.45,13.56 0 top
RXD  46.67,36.74 270 top
SCL  50.17,43.73 270 top
SDA  50.17,46.27 270 top
STATUS  29.21,42.46 180 top
T3  48.26,14.2 0 top
T4  43.18,15.79 90 top
TLC0  72.39,19.6 90 top
TLC1  72.39,50.08 90 top
TLC2  11.43,48.81 270 top
TLC3  11.43,18.33 270 top
TXD  49.21,36.74 270 top
U$9  38.73,38.65 180 top
VCC  78,4 270 top

### Tracks (layer width: path | path; a pad name or v marks a point on that pad's centre or on a via)
+3V3  (via drill 0.61)
  Top 0.406: IC4.4 31.77,5.31 R9.2 | R9.2 37.88,7.22 26.04,7.22 25.4,7.85 25.4,17.59 C2.1 | R9.2 39.69,5.41 v39.69,7.85
  Top 0.61: C2.1 R22.2
  Bottom 0.406: IC2.P$2 31.1,16.44 v39.69,7.85 40.64,6.9 42.07,6.9 51.35,16.17 IC2.P$17
BLANK  (via drill 0.61)
  Top 0.254: TLC0.18 71.12,21.65 71.12,29.76 v73.66,29.76 | TLC3.18 12.68,5.31 20,5.31 20,21.5 38.73,21.5 46.04,28.81 v50.48,28.81 | TLC2.18 12.68,46.27 14.6,46.27 14.6,47.54 22.7,47.54 22.7,61.51 59.53,61.51 v59.53,45.32 v70.64,45.32 | TLC1.18 71.14,60.24 v73.66,60.24
  Top 0.305: v50.48,39.28 50.48,40.87 45.72,40.87 45.72,44.57 46.67,45.53 46.67,46.09 IC1.16
  Bottom 0.254: v59.53,45.32 59.53,39.28 v50.48,39.28 | v73.66,29.76 73.66,45.32 | 73.66,45.32 v70.64,45.32 | v73.66,60.24 73.66,45.32
  Bottom 0.305: 50.48,32.61 v50.48,28.81 v50.48,39.28
GND  (via drill 0.61)
  Top 0.254: TLC0.22 68.33,19.35 67.73,18.75 C8.1 | TLC3.22 14.7,18.58 15.3,19.18 C5.1 | TLC2.22 16.29,49.06 C6.1 | TLC1.22 60.75,49.83 C7.1
  Top 0.305: T4.2 44.76,16.74 | v34.92,14.52 34.92,17.69 36.83,17.69 C1.2 | C16.2 v70.48,13.56 | C15.2 v61.6,12.61
  Top 0.406: 62.23,57.06 62.23,55.31 R15.1 | C9.1 48.26,57.06 IC1.28 v43.82,52.62 | U$9.P$2 36.78,39.6 | v16.19,21.19 C5.1 18.41,19.18 R17.1 18.41,8.79 R17.2 | C7.1 60.64,51.98 v60.64,57.06 62.23,57.06 | R16.2 v19.69,57.7 18.73,57.7 R16.1 18.73,55.8 16.29,53.36 C6.1 | C2.2 v26.67,9.12 | R11.1 44.45,12.51 v44.45,13.09 | R10.1 49.21,14.3 T3.2 50.31,13.1 v51.44,11.98 | IC1.18 48.26,46.76 48.26,44.68 48.89,44.05 48.89,42.08 | v50.01,41.82 48.89,41.82 48.89,42.08 | C11.1 48.89,42.08 | v28.57,57.7 30.9,57.7 31.06,57.54 C12.1 | IC1.39 39.69,54.2 v39.69,52.62 | STATUS.C v29.21,27.53 | R14.2 | R14.2 v58.9,37.06 | C8.1 57.95,18.75 R14.1 57.95,32.63 R14.2 | R15.2 62.23,58.66 62.23,57.06 | C15.2 59.91,11.56 59.16,10.81 R28.1 | U$9.P$4 40.94,36.21 C3.1 | 44.76,16.74 44.77,16.74 v46.35,16.74
  Top 0.508: IC1.6 36.83,45.63 36.83,44.43 C10.1 34.92,42.53 34.92,39.6 | 39.58,33.57 36.83,33.57 34.92,35.47 34.92,39.6 | 36.78,39.6 34.92,39.6 | U$9.P$4 39.21,37.45 v39.21,36.58 | R21.1 C1.2 | 39.58,33.57 C4.1 | 39.58,33.57 41.91,33.57 43.82,35.47 C3.1
  Top 1.016: C14.1 60.96,3.86 | 60.96,3.86 C13.- | 60.96,3.86 60.96,1.82 73,1.82 GND.1
  Bottom 0.305: 60.32,37.06 60.32,18.33 | 56.83,18.33 60.32,18.33 | v70.48,13.56 66.67,13.56 66.67,33.25 | v61.6,12.61 60.32,12.61 60.32,18.33
  Bottom 0.406: 27.3,22.45 27.3,18.01 19.37,18.01 v16.19,21.19 | 27.3,22.45 39.21,22.45 JP3.6 v39.21,36.58 | v60.64,57.06 58.74,57.06 | 58.74,57.06 43.82,57.06 | 43.82,57.06 v43.82,52.62 | v19.69,57.7 37.15,57.7 37.78,57.06 43.82,57.06 | IC2.P$38 27.44,5.18 26.67,5.95 v26.67,9.12 29.85,9.12 IC2.P$1 | IC2.P$18 IC2.P$19 54.48,20.68 56.83,18.33 51.44,12.93 v51.44,11.98 | 58.74,57.06 58.74,52.3 63.18,52.3 63.18,37.06 60.32,37.06 v58.9,37.06 | 27.3,22.45 27.3,27.53 v29.21,27.53 | v39.21,36.58 | v43.82,52.62 43.82,44.68 | 43.82,44.68 43.82,41.82 v50.01,41.82 | v39.21,36.58 39.21,44.68 43.82,44.68 | v46.35,16.74 46.35,14.99 v44.45,13.09 40.8,9.44 40.01,9.44 v34.92,14.52 | v39.69,52.62 v43.82,52.62 | 66.67,33.25 60.32,33.25 60.32,18.33 60.32,1.98 73,1.98 GND.1
  pour Top: 0,65 0,-1.67 85.09,-1.67 85.09,65
  pour Bottom: 0,65 -0.63,-4.22 85.09,-4.22 85.09,65
LATCH  (via drill 0.61)
  Top 0.254: TLC1.1 71.14,46.27 v60.64,46.27 | TLC0.1 71.14,15.47 54.29,15.47 54.29,31.66 | 54.29,31.66 v54.29,46.27 | 23.5,23.41 12.68,23.41 TLC3.1 | 23.5,23.41 37.78,23.41 46.04,31.66 54.29,31.66 | TLC2.1 12.68,56.75 v16.51,56.75 | v23.5,29.76 23.5,23.41
  Top 0.305: v54.29,46.27 54.29,54.52 49.11,54.52 IC1.25
  Bottom 0.254: v16.51,56.75 16.51,39.6 23.5,39.6 v23.5,29.76
  Bottom 0.305: v60.64,46.27 v54.29,46.27
MISO
  Top 0.406: IC1.2 32.38,45.71 32.38,32.25 JP3.1
MOS0
  Top 0.406: R8.1 61.6,38.33 56.51,38.33 56.51,58.97 47.9,58.97 IC1.30
MOS1
  Top 0.406: R7.1 63.5,38.97 57.15,38.97 57.15,59.6 47.41,59.6 IC1.31
MOS2
  Top 0.406: IC1.33 46.41,60.87 58.42,60.87 58.42,42.46 R6.1
MOS3
  Top 0.406: R5.1 57.79,40.23 57.79,60.24 46.91,60.24 IC1.32
MOS4
  Top 0.406: IC1.34 38.84,60.71 23.65,60.71 23.65,40.34 R1.1
MOS5
  Top 0.406: IC1.35 38.34,60.08 24.29,60.08 24.29,38.65 20.32,38.65 R2.1
MOS6
  Top 0.406: IC1.37 37.35,58.81 25.56,58.81 25.56,36.43 R3.1
MOS7
  Top 0.406: IC1.36 37.84,59.44 24.92,59.44 24.92,38.01 20.32,38.01 R4.1
MOSI
  Top 0.406: IC1.1 31.75,46.21 31.75,31.03 35.56,27.22 37.41,29.07 JP3.4
N$1
  Top 0.406: IC1.8 38.73,45.27 38.73,39.92 40.94,39.92 U$9.P$1 42.61,39.85 43.82,38.65 C3.2
N$2  (via drill 0.61)
  Top 0.406: 46.35,7 R13.1 | R11.2 46.35,7 | 46.35,7 v46.35,6.9
  Bottom 0.406: IC2.P$26 v46.35,6.89 v46.35,6.9
N$3
  Top 0.406: IC1.7 38.1,45.77 38.1,37.45 | 38.1,37.45 U$9.P$3 | 38.1,37.45 38.1,35.05 C4.2
N$4
  Top 0.406: R2.2 20.32,45 15.88,45 IRF3.2
N$5  (via drill 0.61)
  Top 0.406: R9.1 41.59,5.31 v41.59,8.17
  Bottom 0.406: v41.59,8.17 50.1,16.67 IC2.P$16
N$6  (via drill 0.61)  (1 unrouted)
  Top 0.406: 51.11,24.19 51.11,24.2 | DATA.A v47.63,24.2
  Bottom 0.406: v47.63,24.2 46.2,24.2 43.85,21.85 IC2.P$11
N$7
  Top 0.406: DATA.C R10.2
N$8
  Top 0.406: R1.2 22.38,45.63 13.33,45.63 IRF3.4
N$9
  Top 0.406: R4.2 20.32,25.95 IRF2.4
N$10  (via drill 0.61)
  Top 0.406: R18.1 53.13,7.64 53.98,8.48 53.98,12.14 v51.44,14.68
  Bottom 0.406: IC2.P$27 45.1,8.34 v51.44,14.68
N$11
  Top 0.406: R18.2 51.44,10.39 50.8,11.03 48.26,11.03 47.31,11.98 T3.1
N$12
  Top 0.406: R19.1 T3.3 46.19,15.3 45.72,14.84 T4.1
N$13
  Top 0.406: R3.2 21.59,36.43 21.59,24.36 14.6,24.36 IRF2.2
N$14
  Top 0.61: IC4.1 34.05,13.17 33.02,14.2 R21.2 R22.1
N$15
  Top 0.406: R5.2 63.5,40.23 63.5,43.73 66.67,43.73 IRF1.4
N$16
  Top 0.406: IRF1.2 69.22,44.36 62.13,44.36 R6.2
N$17
  Top 0.406: R7.2 63.5,23.41 67.63,23.41 IRF0.2
N$18
  Top 0.406: R8.2 61.6,22.77 70.17,22.77 IRF0.4
N$19
  Top 0.254: TLC3.20 14.45,17.58 14.45,14.2
  Top 0.305: 14.45,14.2 R24.1
N$20
  Top 0.305: R24.2 arc90 16.31,14.11
  Top 0.406: 16.31,14.11 16.51,13.9 R17.3
N$21
  Top 0.406: R16.3 21.65,54.94 R26.2
N$22
  Top 0.254: R26.1 19.95,48.06 TLC2.20
N$23
  Top 0.254: TLC1.20 67.52,50.83 R23.2
N$24
  Top 0.406: R15.3 65.82,53.94 R23.1
N$25
  Top 0.406: R25.2 59.85,20.87 R14.3
N$26
  Top 0.254: TLC0.20 69.22,20.35 69.22,22.14 63.72,22.14 R25.1
N$27
  Bottom 0.61: ANT.1 30.48,3.4 31.11,4.04 31.11,5.16 IC2.P$37
N$28
  Top 0.406: R27.2 31.75,48.48 29.21,45.95 STATUS.A
N$29  (via drill 0.61)
  Top 0.305: IC3.1 64.35,4.36 v62.55,4.36 | R28.2 v62.55,9.75 63.6,9.75 R29.1
  Bottom 0.305: v62.55,4.36 v62.55,9.75
OUT1H0
  Top 0.406: LED-TOP.19 80.01,31.66 70.17,31.66 IRF0.5 IRF0.6
OUT1H1
  Top 0.406: LED-TOP.20 67.63,32.93 IRF0.7 IRF0.8
OUT1H2
  Top 0.406: LED-TOP.21 80.01,34.2 70.48,34.2 IRF1.8 IRF1.7
OUT1H3
  Top 0.406: LED-TOP.22 75.57,37.38 67.95,37.38 IRF1.6 IRF1.5
OUT1H4
  Top 0.406: LED-BOT.19 3.81,36.11 13.33,36.11 IRF3.5 IRF3.6
OUT1H5
  Top 0.406: LED-BOT.20 15.88,34.84 IRF3.7 IRF3.8
OUT1H6
  Top 0.305: IRF2.7 IRF2.8
  Top 0.406: LED-BOT.21 5.08,33.57 13.33,33.57 IRF2.8
OUT1H7
  Top 0.305: IRF2.6 IRF2.5
  Top 0.406: LED-BOT.22 9.84,32.3 9.84,31.03 15.88,31.03 IRF2.6
OUT1L0
  Top 0.254: LED-TOP.1 80.01,8.8 71.64,8.8 TLC0.2
OUT1L1
  Top 0.254: LED-TOP.2 72.14,10.07 TLC0.3
OUT1L2
  Top 0.254: LED-TOP.3 80.01,11.34 72.64,11.34 TLC0.4
OUT1L3
  Top 0.254: LED-TOP.4 73.14,12.61 TLC0.5
OUT1L4
  Top 0.254: LED-TOP.5 80.01,13.88 73.64,13.88 TLC0.6
OUT1L5
  Top 0.254: TLC0.7 74.93,18.35 74.93,15.15 LED-TOP.6
OUT1L6
  Top 0.254: TLC0.8 75.57,18.85 75.57,16.42 80.01,16.42 LED-TOP.7
OUT1L7
  Top 0.254: TLC0.9 75.82,19.35 LED-TOP.8
OUT1L8
  Top 0.254: TLC0.10 75.95,19.85 76.83,18.96 78.74,18.96 LED-TOP.9
OUT1L9
  Top 0.254: TLC0.11 77.35,20.35 LED-TOP.10
OUT1L10
  Top 0.254: TLC0.12 74.44,20.87 75.57,20.87 75.57,21.5 80.01,21.5 LED-TOP.11
OUT1L11
  Top 0.254: LED-TOP.12 73.64,22.77 TLC0.13
OUT1L12
  Top 0.254: LED-TOP.13 80.01,24.04 73.14,24.04 TLC0.14
OUT1L13
  Top 0.254: LED-TOP.14 72.64,25.31 TLC0.15
OUT1L14
  Top 0.254: LED-TOP.15 80.01,26.58 72.14,26.58 TLC0.16
OUT1L15
  Top 0.254: LED-TOP.16 71.64,27.85 TLC0.17
OUT2L0
  Top 0.254: TLC1.2 71.64,39.28 80.01,39.28 LED-TOP.25
OUT2L1
  Top 0.254: LED-TOP.26 72.14,40.55 TLC1.3
OUT2L2
  Top 0.254: LED-TOP.27 80.01,41.82 72.64,41.82 TLC1.4
OUT2L3
  Top 0.254: LED-TOP.28 73.14,43.09 TLC1.5
OUT2L4
  Top 0.254: LED-TOP.29 80.01,44.36 73.64,44.36 TLC1.6
OUT2L5
  Top 0.254: LED-TOP.30 74.77,45.63 74.77,48.83 TLC1.7
OUT2L6
  Top 0.254: TLC1.8 75.41,49.33 75.41,46.9 80.01,46.9 LED-TOP.31
OUT2L7
  Top 0.254: TLC1.9 75.97,49.83 75.97,48.17 LED-TOP.32
OUT2L8
  Top 0.254: TLC1.10 76.11,50.33 76.99,49.44 78.74,49.44 LED-TOP.33
OUT2L9
  Top 0.254: TLC1.11 77.35,50.83 LED-TOP.34
OUT2L10
  Top 0.254: TLC1.12 75.57,51.33 75.57,51.98 80.01,51.98 LED-TOP.35
OUT2L11
  Top 0.254: LED-TOP.36 73.64,53.25 TLC1.13
OUT2L12
  Top 0.254: LED-TOP.37 80.01,54.52 73.14,54.52 TLC1.14
OUT2L13
  Top 0.254: LED-TOP.38 72.64,55.79 TLC1.15
OUT2L14
  Top 0.254: LED-TOP.39 80.01,57.06 72.14,57.06 TLC1.16
OUT2L15
  Top 0.254: LED-TOP.40 71.64,58.33 TLC1.17
OUT3L0
  Top 0.254: TLC2.2 12.18,58.97 3.81,58.97 LED-BOT.1
OUT3L1
  Top 0.254: LED-BOT.2 11.68,57.7 TLC2.3
OUT3L2
  Top 0.254: TLC2.4 11.18,56.43 3.81,56.43 LED-BOT.3
OUT3L3
  Top 0.254: TLC2.5 10.68,55.16 LED-BOT.4
OUT3L4
  Top 0.254: TLC2.6 10.18,53.89 3.81,53.89 LED-BOT.5
OUT3L5
  Top 0.254: TLC2.7 8.89,50.06 8.89,52.62 LED-BOT.6
OUT3L6
  Top 0.254: TLC2.8 8.26,49.56 8.26,51.35 3.81,51.35 LED-BOT.7
OUT3L7
  Top 0.254: TLC2.9 8.01,49.06 6.98,50.08 LED-BOT.8
OUT3L8
  Top 0.254: TLC2.10 7.23,48.56 6.98,48.81 5.08,48.81 LED-BOT.9
OUT3L9
  Top 0.254: TLC2.11 7.62,48.06 7.62,47.54 LED-BOT.10
OUT3L10
  Top 0.254: TLC2.12 8.26,47.56 8.26,46.27 3.81,46.27 LED-BOT.11
OUT3L11
  Top 0.254: TLC2.13 10.18,45 LED-BOT.12
OUT3L12
  Top 0.254: TLC2.14 10.68,43.73 3.81,43.73 LED-BOT.13
OUT3L13
  Top 0.254: TLC2.15 11.18,42.46 LED-BOT.14
OUT3L14
  Top 0.254: TLC2.16 11.68,41.19 3.81,41.19 LED-BOT.15
OUT3L15
  Top 0.254: TLC2.17 12.18,39.92 LED-BOT.16
OUT4L0
  Top 0.254: LED-BOT.25 5.08,28.49 12.18,28.49 TLC3.2
OUT4L1
  Top 0.254: LED-BOT.26 11.68,27.22 TLC3.3
OUT4L2
  Top 0.254: LED-BOT.27 5.08,25.95 11.18,25.95 TLC3.4
OUT4L3
  Top 0.254: LED-BOT.28 10.68,24.68 TLC3.5
OUT4L4
  Top 0.254: LED-BOT.29 5.08,23.41 10.18,23.41 TLC3.6
OUT4L5
  Top 0.254: LED-BOT.30 8.89,22.14 8.89,19.58 TLC3.7
OUT4L6
  Top 0.254: LED-BOT.31 5.08,20.87 8.26,20.87 8.26,19.08 TLC3.8
OUT4L7
  Top 0.254: TLC3.9 7.69,18.58 6.67,19.6 LED-BOT.32
OUT4L8
  Top 0.254: TLC3.10 7.23,18.08 6.98,18.33 5.08,18.33 LED-BOT.33
OUT4L9
  Top 0.254: LED-BOT.34 7.62,17.06 7.62,17.58 TLC3.11
OUT4L10
  Top 0.254: TLC3.12 8.26,17.08 8.26,15.79 5.08,15.79 LED-BOT.35
OUT4L11
  Top 0.254: LED-BOT.36 10.18,14.52 TLC3.13
OUT4L12
  Top 0.254: LED-BOT.37 5.08,13.25 10.68,13.25 TLC3.14
OUT4L13
  Top 0.254: LED-BOT.38 11.18,11.98 TLC3.15
OUT4L14
  Top 0.254: LED-BOT.39 5.08,10.71 11.68,10.71 TLC3.16
OUT4L15
  Top 0.254: LED-BOT.40 12.18,9.44 TLC3.17
PORTB0
  Top 0.406: IC1.40 36.65,56.11 29.53,56.11 28.26,54.84 PB0.1
PORTB1
  Top 0.406: IC1.41 36.15,55.47 29.85,55.47 28.89,54.52 28.89,52.3 PB1.1
PORTB2
  Top 0.406: IC1.42 35.66,54.84 30.16,54.84 29.53,54.2 29.53,49.76 PB2.1
PORTB3
  Top 0.406: IC1.43 35.16,54.2 30.48,54.2 30.16,53.89 30.16,48.49 28.89,47.22 PB3.1
PORTB4
  Top 0.406: IC1.44 34.67,53.57 31.75,53.57 R27.1
RST
  Top 0.406: JP3.5 37.41,25 | 37.41,25 36.83,25 31.11,30.71 31.11,46.58 35.88,51.35 37.15,51.35 38.73,49.76 37.35,48.38 IC1.4 | R12.1 45.51,32.08 38.42,25 37.41,25
RXD  (via drill 0.61)
  Top 0.305: R13.2 44.45,10.39 43.02,11.82 v43.02,13.25
  Top 0.406: v41.59,42.14 40.01,43.73 40.01,44.28 IC1.10
  Bottom 0.305: v41.59,42.14 41.59,42.12 43.02,40.69 v43.02,13.25
RXD1
  Top 0.406: RXD.1 46.67,39.28 44.45,39.28 44.45,40.92 41.27,44.1 IC1.11
SCK
  Top 0.406: IC1.3 33.02,45.22 33.02,33.41 35.61,30.81 JP3.3
SCKD  (via drill 0.61)
  Top 0.254: TLC1.24 69.85,48.83 69.85,47.54 v61.6,47.54 | TLC0.24 69.85,18.35 69.85,16.42 55.25,16.42 v55.25,27.85 | TLC3.24 13.81,19.58 13.81,22.77 38.1,22.77 46.04,30.71 52.39,30.71 v52.39,27.85 46.04,27.85 38.73,20.55 v22.54,20.55 | TLC2.24 13.81,50.06 13.81,51.35 13.49,51.35 13.49,55.63 v15.4,55.63
  Top 0.305: v55.25,27.85 v55.25,47.54 55.25,55.16 48.62,55.16 IC1.26
  Bottom 0.254: v15.4,55.63 15.4,38.97 22.54,38.97 v22.54,20.55
  Bottom 0.305: v61.6,47.54 v55.25,47.54 | v52.39,27.85 v55.25,27.85
SCL
  Top 0.406: IC1.19 48.89,47.26 48.89,45 SCL.1
SDA
  Top 0.406: SDA.1 50.17,47.12 IC1.20
SDAD0  (via drill 0.61)
  Top 0.254: TLC0.23 69.22,18.85 69.22,17.37 56.2,17.37 v56.2,34.68
  Top 0.305: v51.44,34.68 51.44,46.98 IC1.21
  Bottom 0.305: v56.2,34.68 v51.44,34.68
SDAD1  (via drill 0.61)
  Top 0.254: TLC1.23 69.22,49.33 69.22,48.81 v60.8,48.81
  Top 0.305: v52.39,48.81 52.39,51.98 50.11,51.98 IC1.23
  Bottom 0.305: v60.8,48.81 v52.39,48.81
SDAD2  (via drill 0.61)
  Top 0.254: TLC2.23 14.45,49.56 v14.45,54.2 | v53.34,30.39 53.34,26.9 46.04,26.9 38.42,19.28 v21.43,19.28
  Top 0.305: v53.34,33.57 53.34,53.89 49.61,53.89 IC1.24
  Bottom 0.254: v14.45,54.2 14.45,38.33 21.43,38.33 v21.43,19.28
  Bottom 0.305: v53.34,33.57 v53.34,30.39
SDAD3  (via drill 0.61)
  Top 0.254: TLC3.23 14.45,19.08 14.45,22.14 38.42,22.14 46.04,29.76 v51.44,29.76
  Top 0.305: v52.39,32.61 52.39,47.16 IC1.22
  Bottom 0.305: v52.39,32.61 52.39,29.76 v51.44,29.76
TXD  (via drill 0.61)
  Top 0.406: R20.1 42.01,19.7 40.68,18.37 v40.68,18.33 40.68,15.79 T4.3 | v40.32,41.82 39.37,42.77 39.37,44.78 IC1.9
  Bottom 0.305: v40.68,18.33 40.68,23.76 42.39,25.47 42.39,39.8 40.36,41.82 v40.32,41.82
TXD1
  Top 0.406: TXD.1 49.21,40.23 45.08,40.23 45.08,43.15 IC1.12
V+  (via drill 0.61)
  Top 0.305: C15.1 55.88,10.29 C13.+
  Top 0.61: IRF1.1 70.48,39.6 67.95,39.6 | 67.95,39.6 65.09,39.6 v65.09,27.53 66.36,27.53 | 66.36,27.53 68.9,27.53 IRF0.3 | IRF0.1 66.36,27.53 | IRF1.3 67.95,39.6 | IRF3.3 14.6,40.87 17.14,40.87 | 17.14,40.87 18.73,40.87 18.73,28.49 15.88,28.49 | IRF2.1 13.33,28.49 v14.6,28.49 15.88,28.49 | IRF2.3 15.88,28.49 | IRF3.1 17.14,40.87
  Top 1.016: IC3.3 68.98,6.8 | 68.98,6.8 C14.2 55.88,6.8 C13.+ | 68.98,6.8 78,6.8 VCC.1
  Bottom 0.61: 78,7.85 65.09,7.85 v65.09,27.53 | v14.6,28.49 14.6,17.06 17.46,17.06 17.46,14.52 12.38,14.52 12.38,62.78 77.95,62.78 81.92,58.81 81.92,7.85 78,7.85 | 78,7.85 VCC.1
VCC  (via drill 0.61)  (1 unrouted)
  Top 0.254: 67.73,20.45 68.33,19.85 TLC0.21 | TLC3.21 14.7,18.08 15.3,17.48 C5.2 | TLC2.21 18.42,48.56 v18.42,49.44 | TLC1.21 62.45,50.33 C7.2
  Top 0.305: R29.2 C16.1
  Top 0.406: C8.2 67.73,20.45 68.26,20.98 v68.26,21.19 | C6.2 18.31,51.35 18.42,51.25 v18.42,49.44 | IC1.29 48.4,58.33 55.25,58.33 55.25,57.06 C9.2 | 55.25,56.75 55.25,55.79 48.12,55.79 IC1.27 | IC1.5 37.81,47.81 | 46.65,47.18 IC1.17 47.31,46.58 47.31,43.78 C11.2 | 41.14,53.89 41.27,53.89 | v66.67,57.06 63.5,57.06 63.5,51.98 C7.2 | v16.19,15.79 C5.2 | v69.85,10.71 67.1,10.71 | 66.7,10.71 IC3.4 | C1.1 38.42,15.89 38.42,15.47 | IC1.38 37.49,57.54 C12.2
  Top 0.457: IC1.17 45.08,48.81 45.08,52.76 IC1.27
  Top 0.508: IC1.38 41.14,53.89 | 42.54,53.89 41.27,53.89 41.27,51.21 IC1.5 35.03,44.96 C10.2 33.97,43.98 33.97,34.25 JP3.2 42.38,32.61 44.45,34.68 v49.21,34.68 49.21,33.09 R12.2 | 42.54,53.89 43.95,53.89 IC1.29 | v42.54,60.24 42.54,53.89 | R20.2 41.81,21.4 38.42,18.01 38.42,15.47 38.42,9.12 29.45,9.12 IC4.3 | R20.2 R19.2 | v49.21,25.95 46.35,25.95 45.72,25.31 R20.2
  Top 1.016: 66.7,10.71 67.1,10.71 C16.1
  Bottom 0.406: v16.19,15.79 13.33,15.79 13.33,61.83 18.42,61.83 | 74.93,21.19 v68.26,21.19 | 74.93,21.19 74.93,61.83 66.67,61.83 | 66.67,61.83 42.54,61.83 | 42.54,61.83 18.42,61.83 | 18.42,61.83 v18.42,49.44 | v42.54,60.24 42.54,61.83 | v66.67,57.06 66.67,61.83 | 74.93,21.19 74.93,10.71 v69.85,10.71
  Bottom 0.508: v49.21,34.68 v49.21,25.95